# Altium schematic sheet Power block scheme.SchDoc
size A4; Organization: My Company; Address1: Address Line 1; Address2: Address Line 2; Address3: Address Line 3; Address4: Address Line 4; SheetNumber: 2; SheetTotal: 8
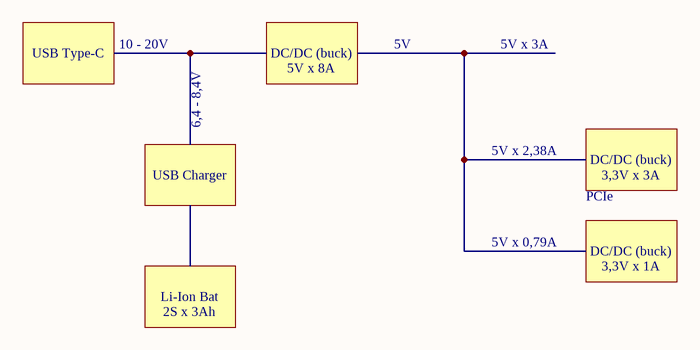
[diagram p0: Power block scheme.SchDoc]

## Notes on the sheet
- USB Type-C
- 10 - 20V
- DC/DC (buck)
- 5V x 8A
- 5V
- 5V x 3A
- 6,4 - 8,4V
- 5V x 2,38A
- USB Charger
- PCIe
- 3,3V x 3A
- Li-Ion Bat
- 2S x 3Ah
- 5V x 0,79A
- 3,3V x 1A
- Title:
- Author:
- Approved:
- Size:
- Date:
- Git Hash:
- A4
- Prj:
- SW Version:
- Variant:
- Edited:
- CONFIDENTIAL
- File: